# Altium project Buck_XLSEMI.PrjPcb
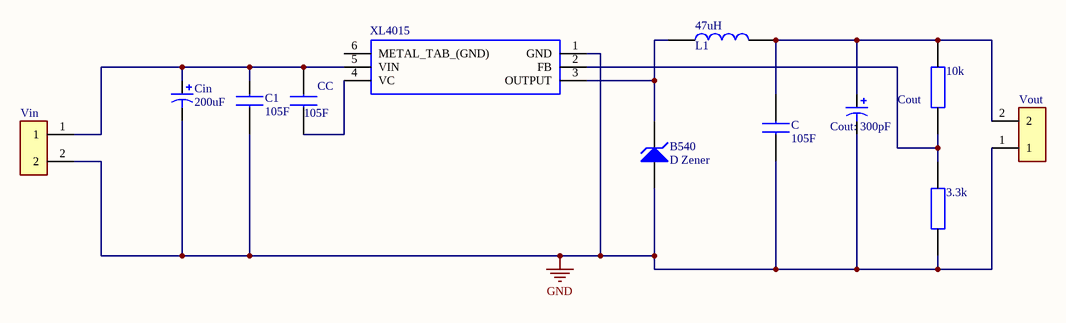
[diagram p0: BUCK_shematics.SchDoc]
1 sheet, 12 parts. Net scope: global (net labels, ports and power ports of the same name join across sheets).
Board file: BUCK_PCB.PcbDoc

## Sheet BUCK_shematics.SchDoc
size A4

### Parts
3.3k  (no value)  [RESC2012X65N]
10k  (no value)  [RESC2012X65N]
47uH  L1  [INDPM110100X400N]
105F  CC  [CAPC2012X145N]
B540  D Zener  [DIODE-0.7]
C  105F  [CAPC2012X145N]
C1  105F  [CAPC2012X145N]
Cin  200uF  [RB7.6-15]
Cout  Cout: 300pF  [RB7.6-15]  (hidden comment: Cin)
Vin  (no value)  [TE_794120-1]
Vout  794120-1  [TE_794120-1]  (value not drawn)
XL4015  (no value)  [TO-263-5]

### Nets
GND: 3.3k.1 B540.1(A) C.1 C1.1 Cin.2 Cout.2 Vin.2 Vout.1 XL4015.1(GND)
Net3.3k_2: 3.3k.2 10k.1 XL4015.2(FB)
Net10k_2: 10k.2 47uH.2 C.2 Cout.1 Vout.2
Net47uH_1: 47uH.1 B540.2(K) XL4015.3(OUTPUT)
Net105F_1: 105F.1 XL4015.4(VC)
Net105F_2: 105F.2 C1.2 Cin.1 Vin.1 XL4015.5(VIN)

Not connected (* = marked no-connect by the designer): XL4015 6(METAL_TAB_(GND))

### Library data of the parts
3.3k 10k = KTR10EZPF5103: Thick Film Resistors - SMD 0805 510Kohm 1% High VoltageAEC-Q200; Manufacturer_Name: ROHM Semiconductor; Geometry.Height: 0.65mm; Manufacturer_Part_Number: KTR10EZPF5103; RS Part Number: *; RS Price/Stock: *; Arrow Part Number: KTR10EZPF5103; Arrow Price/Stock: https://www.arrow.com/en/products/ktr10ezpf5103/rohm-semiconductor; Datasheet Link: http://rohmfs.rohm.com/en/products/databook/datasheet/passive/resistor/chip_resistor/ktr.pdf
47uH = SRP1038A-470M: Inductor SMD shielded AEC-Q200 47uH Bourns SRP1038A Series Shielded Wire-wound SMD Inductor with a Carbonyl Powder Core, 47 H 20% 3A Idc; Allied_Number: 70377524; Geometry.Height: 4mm; Manufacturer_Name: Bourns; Manufacturer_Part_Number: SRP1038A-470M; RS Part Number: 1728637; RS Price/Stock: http://uk.rs-online.com/web/p/products/1728637; Allied Price/Stock: https://www.alliedelec.com/bourns-srp1038a-470m/70377524/; Arrow Part Number: SRP1038A-470M; Arrow Price/Stock: https://www.arrow.com/en/products/srp1038a-470m/bourns; Datasheet Link: http://uk.rs-online.com/web/p/products/8193337
105F C C1 = GRM21BR71H104JA01L: Multilayer Ceramic Capacitors MLCC - SMD/SMT 0805 0.1uF 50volts X7R 5%; Manufacturer_Name: Murata Electronics; Geometry.Height: 1.45mm; Manufacturer_Part_Number: GRM21BR71H104JA01L; RS Part Number: *; RS Price/Stock: *; Arrow Part Number: GRM21BR71H104JA01L; Arrow Price/Stock: https://www.arrow.com/en/products/grm21br71h104ja01l/murata-manufacturing; Datasheet Link: http://www.murata.com/~/media/webrenewal/support/library/catalog/products/capacitor/mlcc/c02e.pdf
B540 = D Zener: Zener Diode; Published: 8-Jun-2000; LatestRevisionDate: 17-Jul-2002; LatestRevisionNote: Re-released for DXP Platform.; PackageReference: DIODE-0.7; Publisher: Altium Limited; PackageDescription: Diode, Thru-Hole; 2 Leads; 0.7 in Pin Spacing
Cin = Cap Pol1: Polarized Capacitor (Radial); Cin: 220pF; Published: 8-Jun-2000; LatestRevisionDate: 17-Jul-2002; LatestRevisionNote: Re-released for DXP Platform.; PackageReference: RB7.6-15; Publisher: Altium Limited; PackageDescription: Polarized Capacitor (Radial); 2 Leads
Cout = Cap Pol1: Polarized Capacitor (Radial); Published: 8-Jun-2000; LatestRevisionDate: 17-Jul-2002; LatestRevisionNote: Re-released for DXP Platform.; PackageReference: RB7.6-15; Publisher: Altium Limited; PackageDescription: Polarized Capacitor (Radial); 2 Leads
Vin Vout = 794120-1: Conn Power HDR 2 POS 5.08mm Solder RA Thru-Hole 2 Terminal 1 Port Automotive Bag; MF: TE Connectivity; SnapEDA_Link: https://www.snapeda.com/parts/794120-1/TE%20Connectivity%20AMP%20Connectors/view-part/2777094/?ref=snap; Value: *; Price: None; Availability: Unavailable; MP: 794120-1; Package: None
XL4015 = AP1506-50K5G-13: DC / DC converters in the housing TO263-5L, Voltage Regulator, Buck Converter, Switching Regulator; Manufacturer_Name: Diodes Inc.; Manufacturer_Part_Number: AP1506-50K5G-13; RS Part Number: *; RS Price/Stock: *; Arrow Part Number: AP1506-50K5G-13; Arrow Price/Stock: https://www.arrow.com/en/products/ap1506-50k5g-13/diodes-incorporated; Datasheet Link: https://www.diodes.com/assets/Datasheets/AP1506.pdf